# EAGLE schematic sample_and_hold (EAGLE 8.2.2)
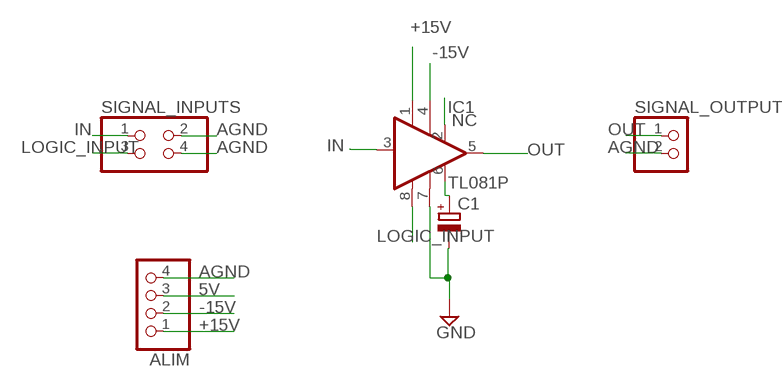
[diagram p0: schematic, sheet 1]

## Parts
ALIM  PINHD-1X4  [1X04]
C1  CPOL-EUE2,5-6E  [E2,5-6E]
IC1  TL081P  [DIL08]
SIGNAL_INPUTS  PINHD-2X2  [2X02]
SIGNAL_OUTPUT  PINHD-1X2  [1X02]

## Nets
5V: ALIM.3
+15V: ALIM.1 IC1.1(V+)
-15V: ALIM.2 IC1.4(V-)
AGND: ALIM.4 C1.- IC1.7(LOGIC_REF) SIGNAL_INPUTS.2 SIGNAL_INPUTS.4 SIGNAL_OUTPUT.2 ; supply symbol labelled GND
IN: IC1.3(IN) SIGNAL_INPUTS.1
LOGIC_INPUT: IC1.8(LOGIC_INPUT) SIGNAL_INPUTS.3
N$2: C1.+ IC1.6(HOLD_CAPACITOR)
NC: IC1.2(OFFSET)
OUT: IC1.5(OUT) SIGNAL_OUTPUT.1

## Library data of the parts
ALIM = pinhead:PINHD-1X4: PIN HEADER
C1 = resistor:CPOL-EU: POLARIZED CAPACITOR, European symbol
IC1 = linear4:TL081: OP AMP
SIGNAL_INPUTS = pinhead:PINHD-2X2: PIN HEADER
SIGNAL_OUTPUT = pinhead:PINHD-1X2: PIN HEADER